# Altium schematic sheet USB_OTG_FS.SchDoc: OTG USB FS
size A4; Date: 01-DEC-2013; Author: A.B; CompanyName: STMicroelectronics; Organization: Microcontrollers Division; Address1: 12, Rue Jules HOROWITZ; Address2: 38019 Grenoble; Address3: FRANCE; DocumentNumber: MB1184; Revision: C-01; SheetNumber: 7; SheetTotal: 10; Project: STM32L476G-DISCO
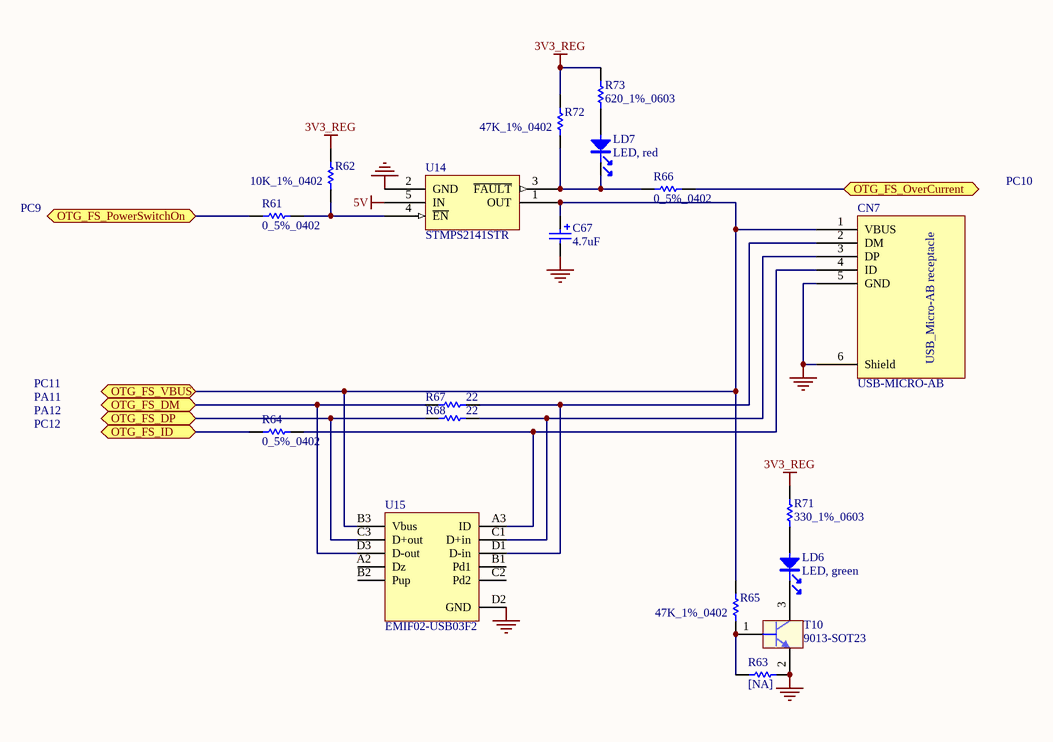
[diagram p0: USB_OTG_FS.SchDoc]

## Parts
C67  4.7uF  [TAN-A]
CN7  USB-MICRO-AB  [USB-MICRO-AB]
LD6  LED, green  [0603D]
LD7  LED, red  [0603D]
R61  0_5%_0402  [0402R]
R62  10K_1%_0402  [0402R]
R63  [NA]  [0402R]
R64  0_5%_0402  [0402R]
R65  47K_1%_0402  [0402R]
R66  0_5%_0402  [0402R]
R67  22  [0402R]
R68  22  [0402R]
R71  330_1%_0603  [0603R]
R72  47K_1%_0402  [0402R]
R73  620_1%_0603  [0603R]
T10  9013-SOT23  [SOT23]
U14  STMPS2141STR  [SOT23-5L]
U15  EMIF02-USB03F2  [Flip Chip]

## Ports
OTG_FS_DM, OTG_FS_DP, OTG_FS_ID, OTG_FS_OverCurrent, OTG_FS_PowerSwitchOn, OTG_FS_VBUS

## Nets
3V3_REG: R62.2 R71.2 R72.2 R73.2
5V: U14.5(IN)
GND: C67.2 CN7.5(GND) CN7.6(Shield) R63.2 T10.2(E) U14.2(GND) U15.D2(GND)
OTG_FS_DM: R67.2 U15.D3(D-out) ; port OTG_FS_DM
OTG_FS_DP: R68.2 U15.C3(D+out) ; port OTG_FS_DP
OTG_FS_ID: R64.1 ; port OTG_FS_ID
OTG_FS_OverCurrent: R66.2 ; port OTG_FS_OverCurrent
OTG_FS_PowerSwitchOn: R61.1 ; port OTG_FS_PowerSwitchOn
OTG_FS_VBUS: C67.1 CN7.1(VBUS) R65.2 U14.1(OUT) U15.B3(Vbus) ; port OTG_FS_VBUS
NetCN7_2: CN7.2(DM) R67.1 U15.D1(D-in)
NetCN7_3: CN7.3(DP) R68.1 U15.C1(D+in)
NetCN7_4: CN7.4(ID) R64.2 U15.A3(ID)
NetLD6_1: LD6.1 R71.1
NetLD6_2: LD6.2 T10.3(C)
NetLD7_1: LD7.1 R73.1
NetLD7_2: LD7.2 R66.1 R72.1 U14.3(~{FAULT})
NetR61_2: R61.2 R62.1 U14.4(~{EN})
NetR63_1: R63.1 R65.1 T10.1(B)

Not connected (* = marked no-connect by the designer): U15 A2(Dz) B1(Pd1) B2(Pup) C2(Pd2)

## Notes on the sheet
- PC9
- PC10
- PC11
- PC12
- PA11
- PA12
- Title:
- Project:
- Size:
- Date:
- A4
- Reference:
- Sheet:
- Revision:
- of
- (in symbol USB-MICRO-AB) USB_Micro-AB receptacle

## Library data of the parts
C67 = Cap_4.7uF_POL_10%_TANA: Polarized Capacitor,4.7uF,16V,10%,typeA,AVX; Manuf_Part_1: TAJA475K016R; Revision: July-2002: Re-released for DXP Platform.; Value: 4.7uF; Manuf_1: AVX; Order: TAJA475K016R
CN7 = USB-MICRO-AB: USB-MICRO-AB, 47590-0001, SMT, MOLEX; Ref St: xxxxxxx; Manuf_1: MOLEX; Manuf_Part_1: 47590-0001; ECCN_US/EU: n/a; Distrib: *
LD6 = LED_green: LED, green, 0603; Manuf_1: everlight; Manuf_Part_1: 19-213SYGC/S530-E2/TR8; Description: LED,green,0603,19-213SYGC/S530-E2/TR8,everlight; ECCN_US/EU: EAR99/NEC; Order: 19-213SYGC/S530-E2/TR8
LD7 = LED_red: LED, red, 0603; Manuf_1: everlight; Manuf_Part_1: 19-213-R6C-AP1Q2B/3T; Description: LED,red,0603,19-213-R6C-AP1Q2B/3T,everlight; ECCN_US/EU: EAR99/NEC; Order: 19-213-R6C-AP1Q2B/3T
R61 R64 R66 = Res_0_5%_0402: Resistor,0,0402,5%,YAGEO; Manuf_Part_1: RC0402JR-070RL; Value: 0; Order: 2363467; ECCN_US/EU: n/a; Manuf_1: YAGEO; Distrib: FARNELL
R62 = Res_10K_1%_0402: Resistor,10K,0402,1%,YAGEO; Manuf_Part_1: RC0402FR-0710KL; Value: 10K; Manuf_1: YAGEO; Order: RC0402FR-0710KL; ECCN_US/EU: n/a
R63 = Res_NA_0402: Resistor,[NA],0402; Fitted: NO; Value: [NA]; ECCN_US/EU: n/a
R65 R72 = Res_47K_1%_0402: Resistor,47K,0402,1%,YAGEO; Manuf_Part_1: RC0402FR-0747KL; Order: 9239430; Value: 47K; Manuf_1: YAGEO; ECCN_US/EU: n/a; Distrib: FARNELL
R67 R68 = Res1: Resistor; Value: 1K; Published: 8-Jun-2000; Revision: July-2002: Re-released for DXP Platform.; Publisher: Altium Limited
R71 = Res_330_1%_0603: Resistor,330,0603,1%,YAGEO; Manuf_Part_1: RT0603FRE07330RL; Value: 330; Order: 1500622RL; ECCN_US/EU: n/a; Manuf_1: YAGEO; Distrib: FARNELL
R73 = Res_620_1%_0603: Resistor,620,0603,1%,VISHAY; Manuf_Part_1: CRCW0603620RFKEA; Manuf_1: VISHAY DRALORIC; Value: 620; Order: 2122341; ECCN_US/EU: n/a; Distrib: FARNELL
T10 = 9013-SOT23: NPN Bipolar Transistor; Manuf_1: NXP; Manuf_Part_1: BSR14; Description: NPN Bipolar Transistor, SOT-23 Footprint; Order: 1081310; ECCN_US/EU: EAR99/NEC; Revision: July-2002: Re-released for DXP Platform.; Distrib: FARNELL
U14 = STMPS2141STR: Enhanced single channel power switches; Manuf_1: STM; Provided: ST; ECCN_US/EU: EAR99/NEC; Ref St: 9159003; Order: STMPS2141STR; Manuf_Part_1: STMPS2141STR; Distrib: ST
U15 = EMIF02-USB03F2: 2-line IPAD, EMI filter including ESD protection; Manuf_1: STM; Provided: ST; ECCN_US/EU: EAR99/NEC; Ref St: 9179037; Order: EMIF02-USB03F2; Manuf_Part_1: EMIF02-USB03F2; Distrib: ST